# Altium schematic sheet 4G图传输原理图AD9.SchDoc
size A0; SheetNumber: 0; SheetTotal: 0
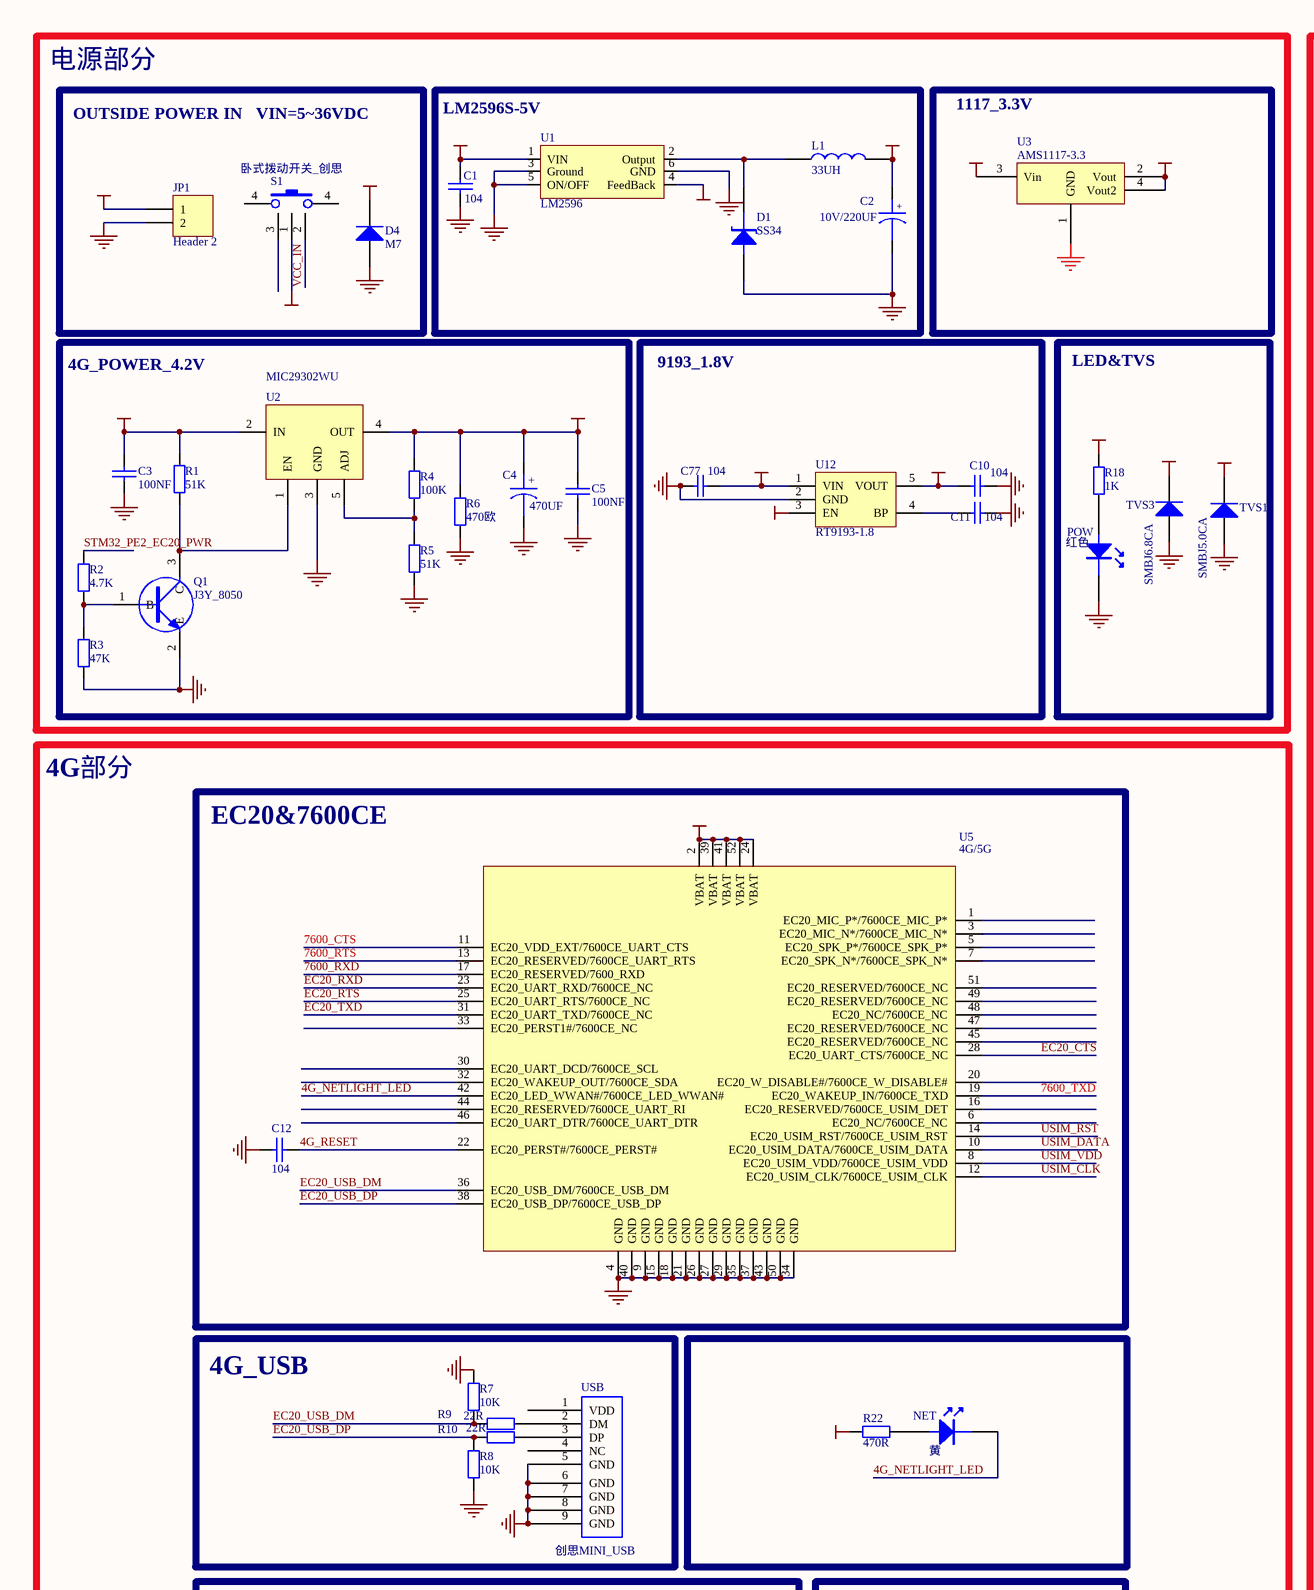
[diagram p0: 4G图传输原理图AD9.SchDoc, top left]
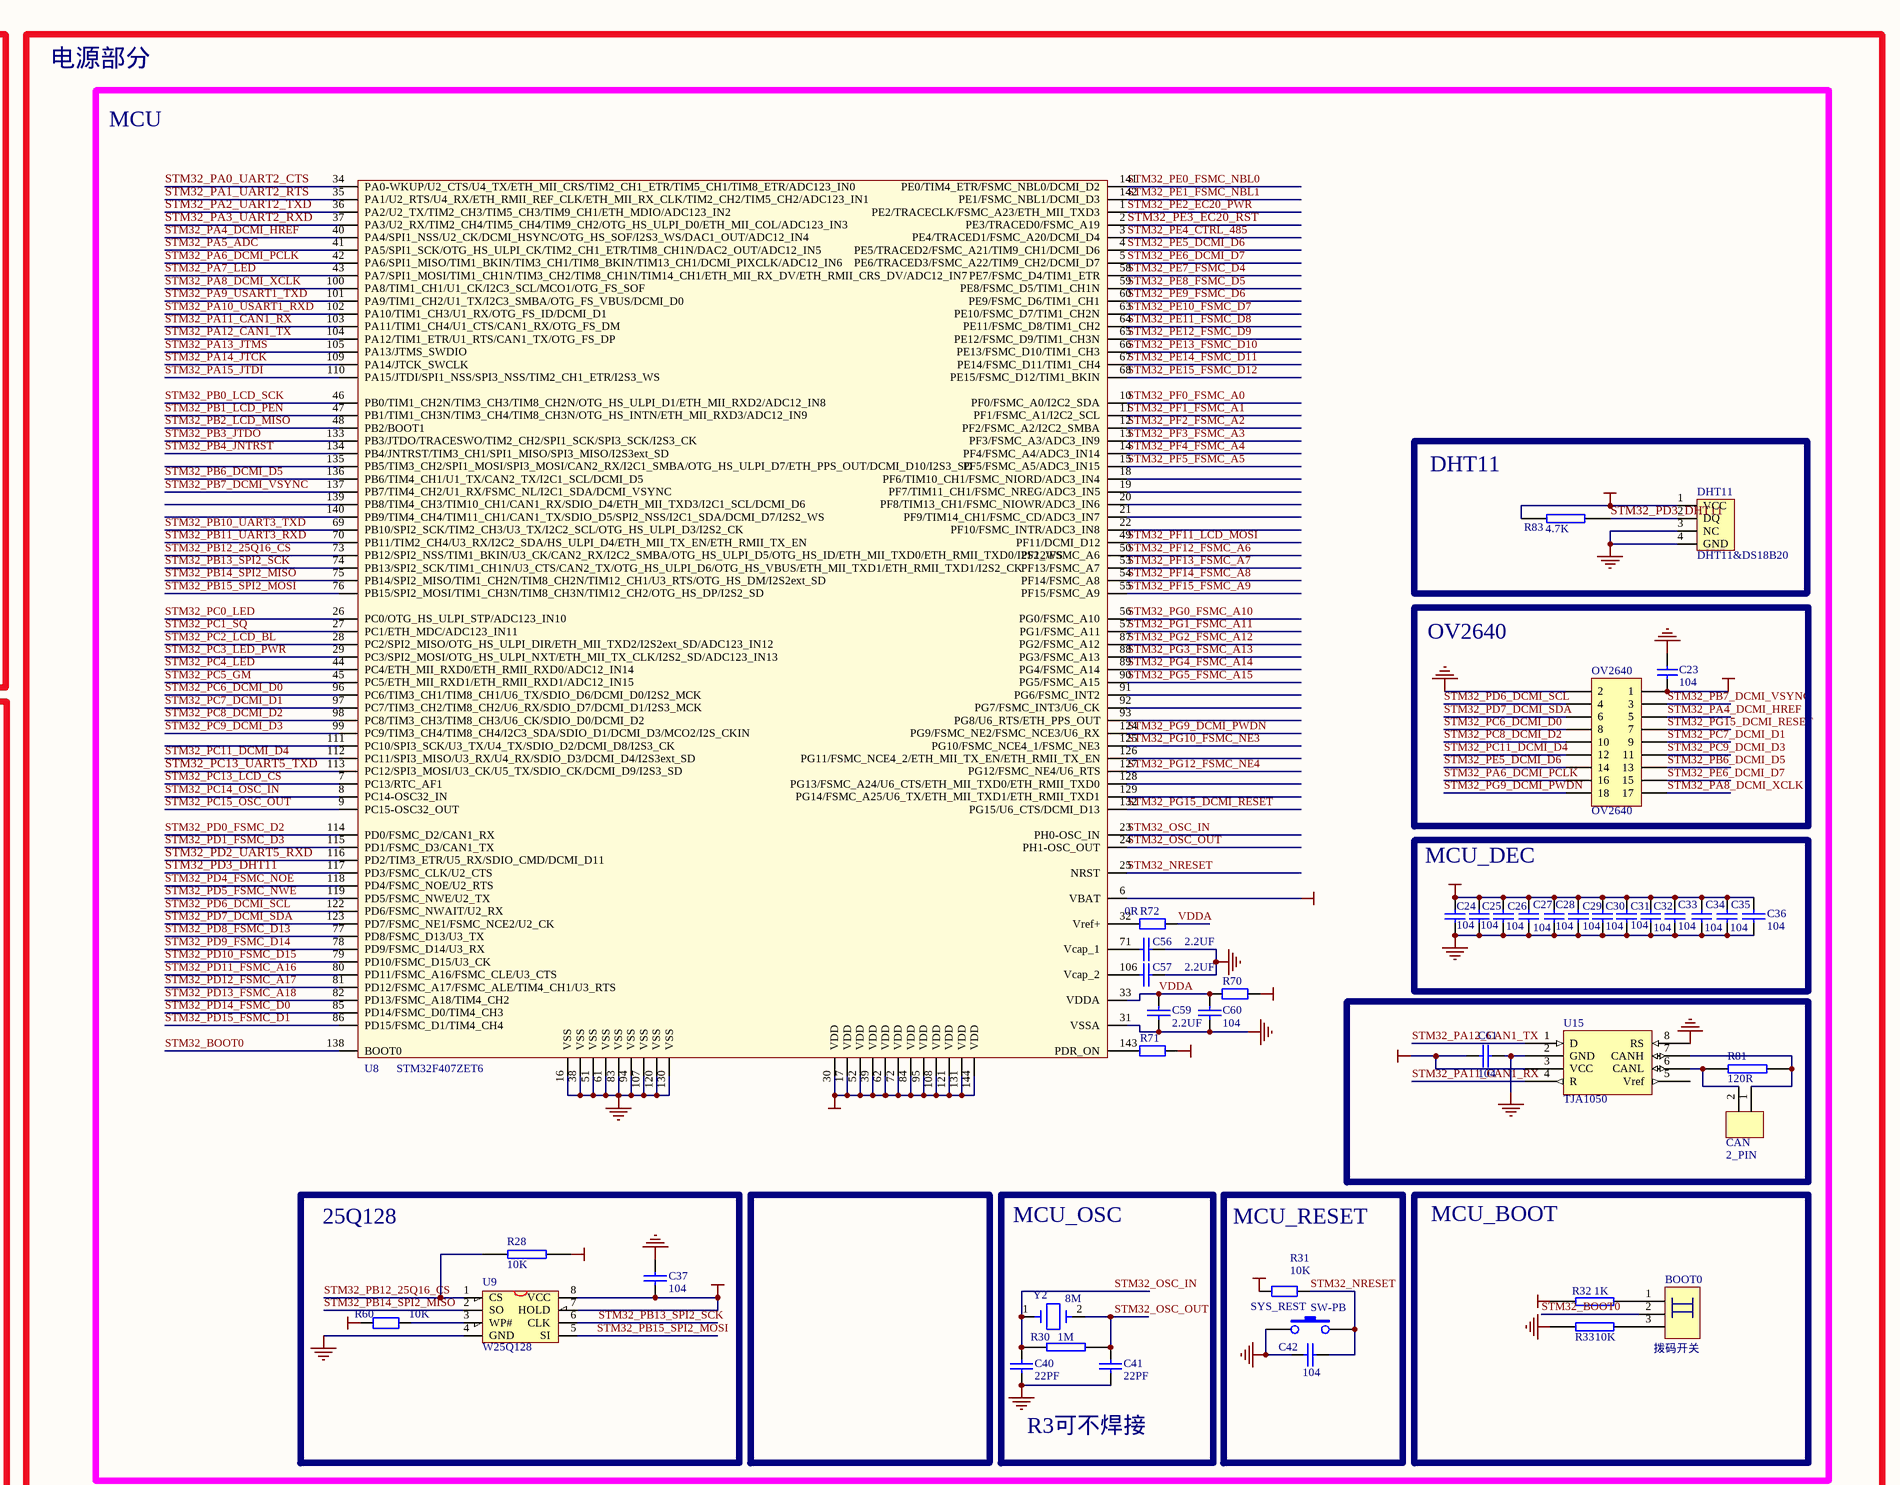
[diagram p1: 4G图传输原理图AD9.SchDoc, top right]
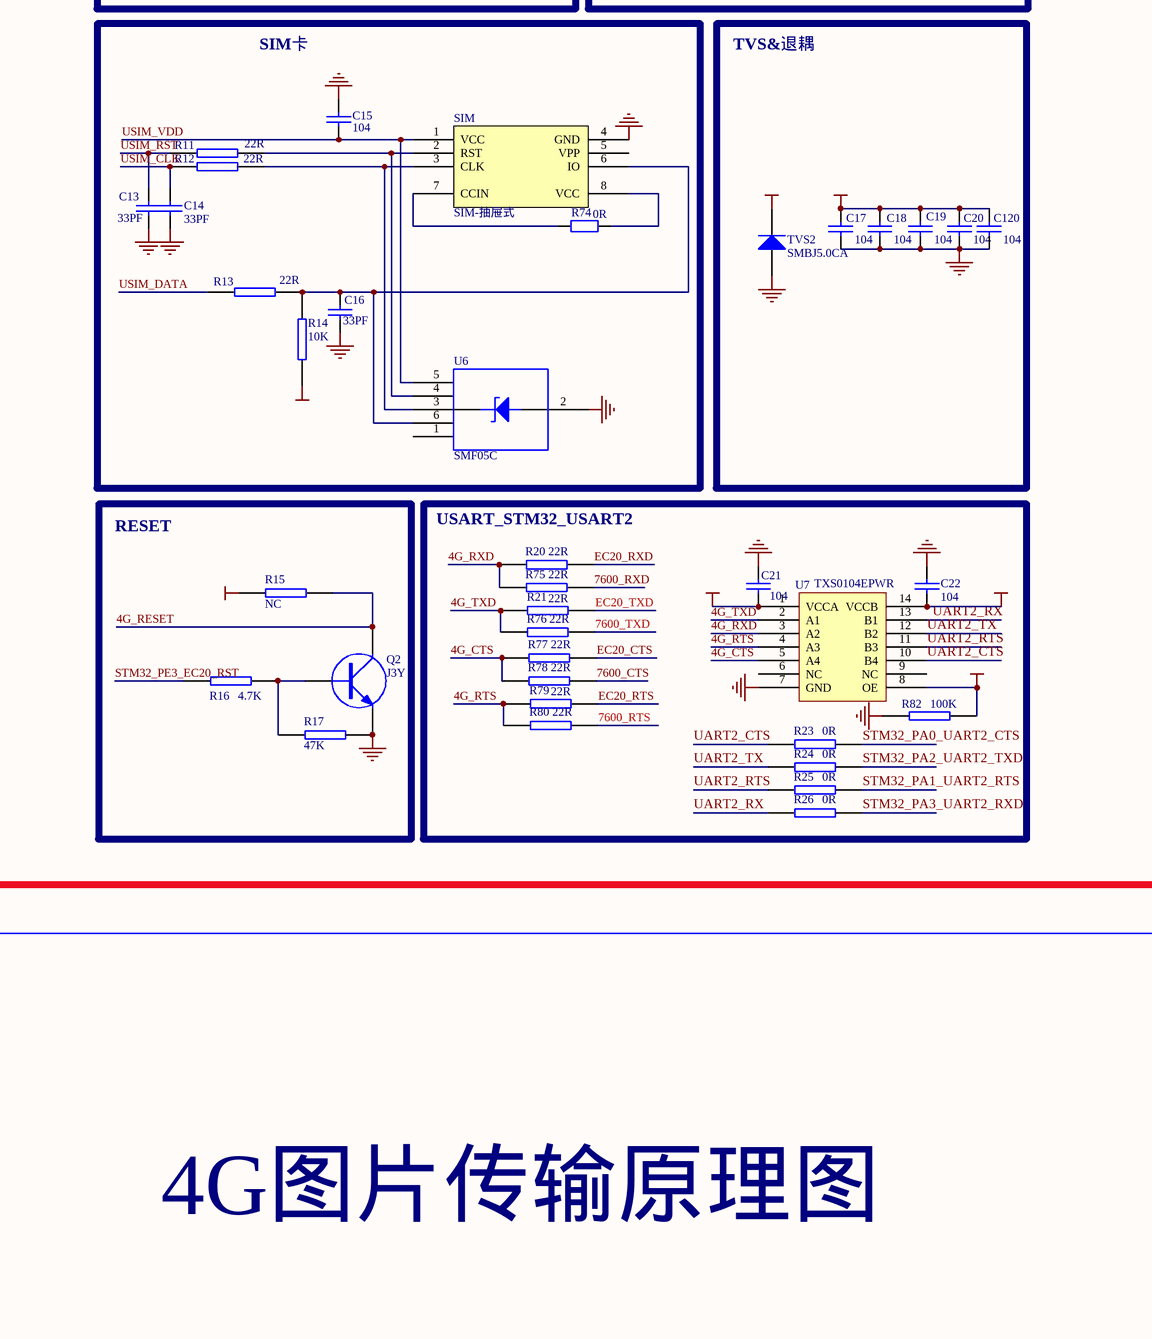
[diagram p2: 4G图传输原理图AD9.SchDoc, bottom left]
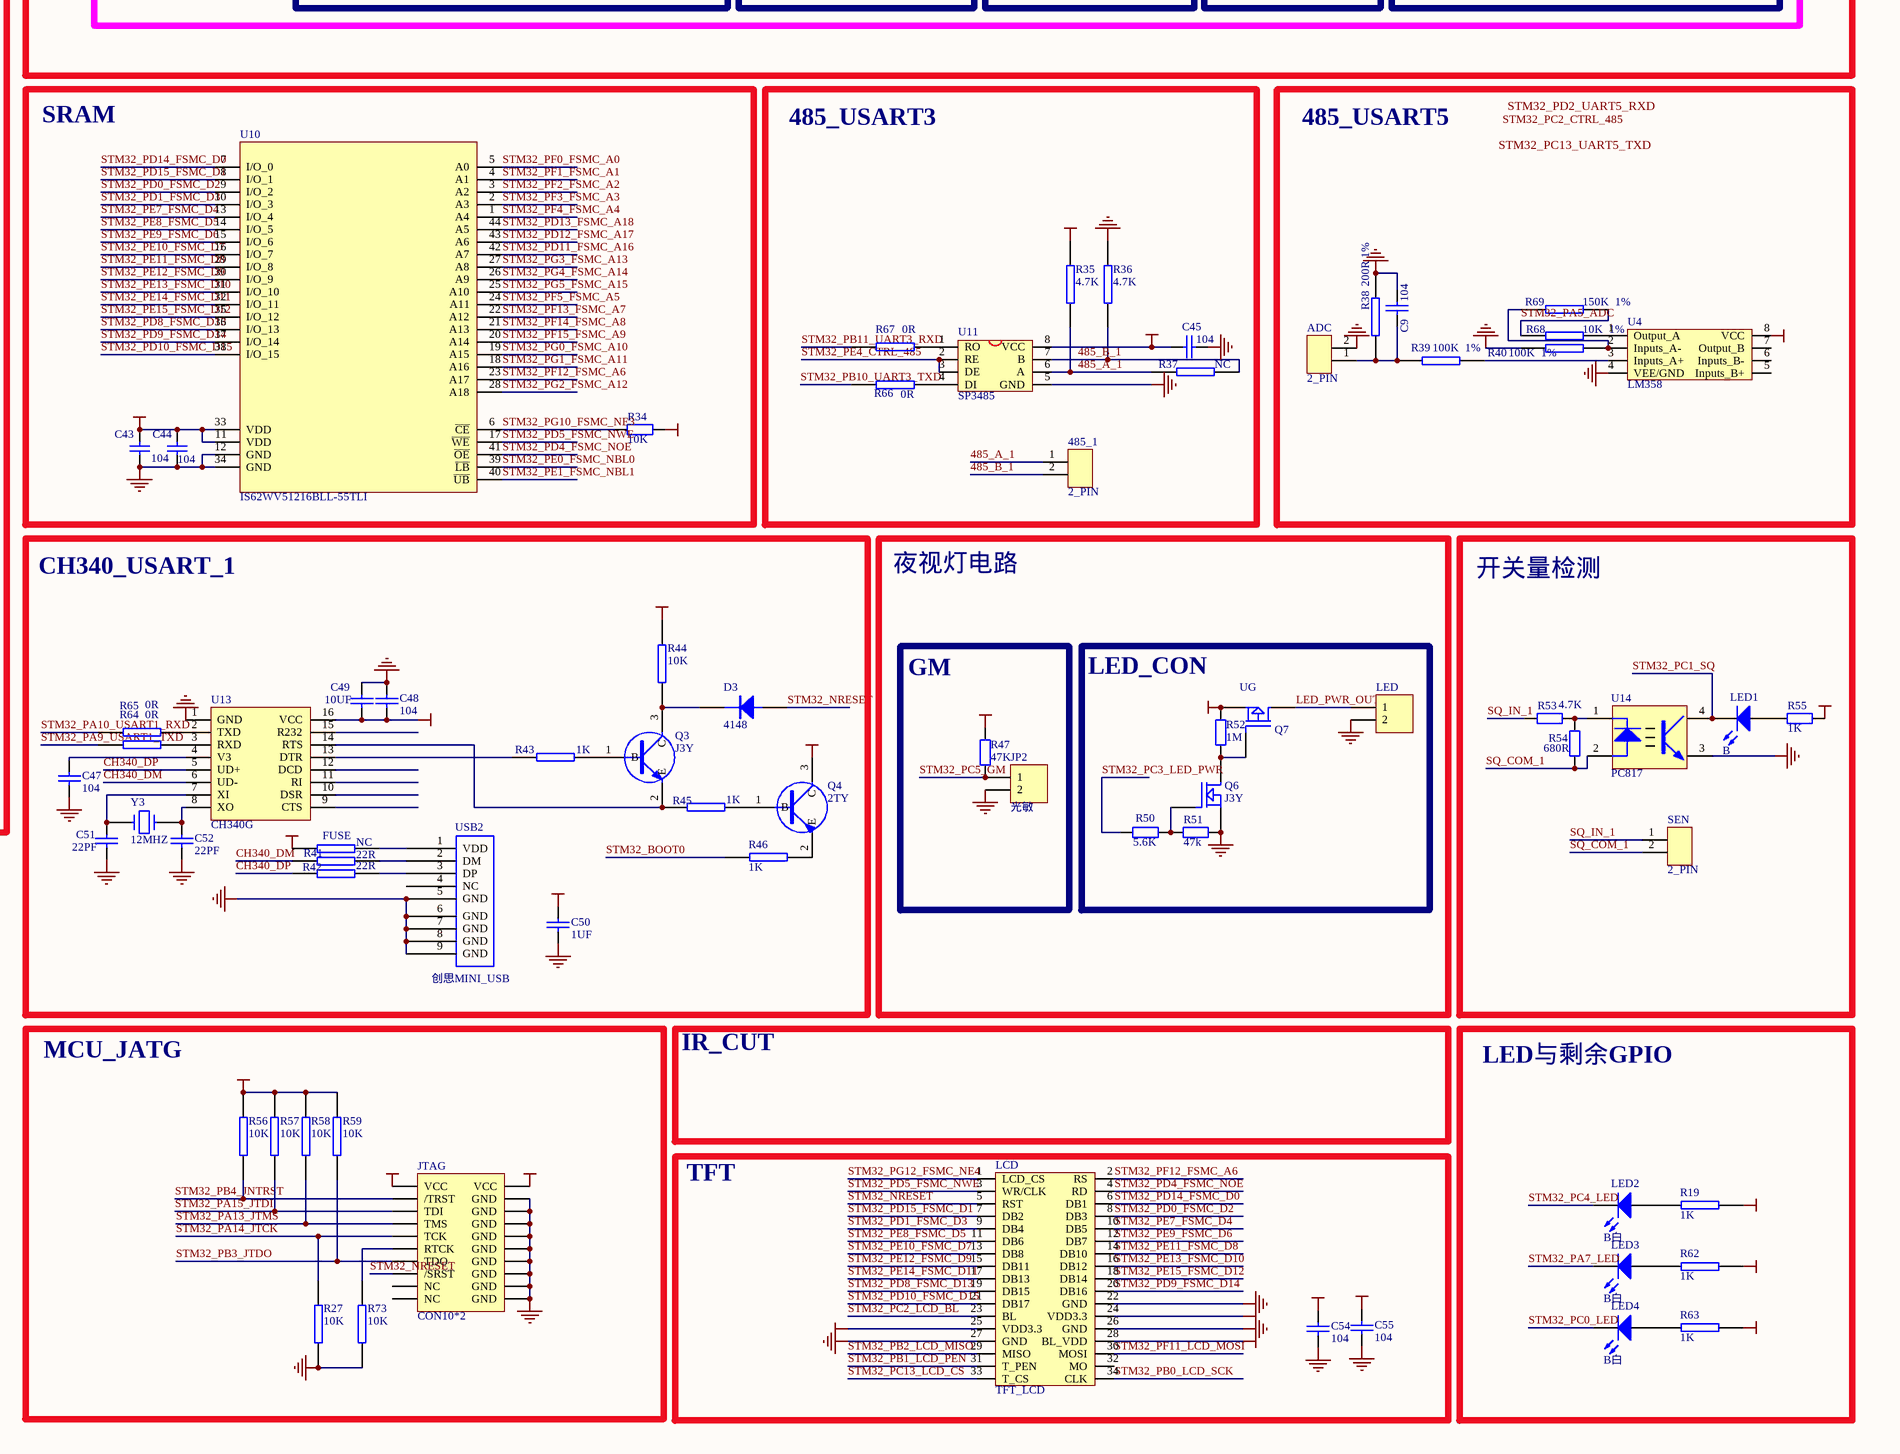
[diagram p3: 4G图传输原理图AD9.SchDoc, bottom right]

## Parts
485_1  2_PIN  [5mm间距蓝色立式端子2P]
ADC  2_PIN  [5mm间距蓝色立式端子2P]
BOOT0  拨码开关  [创思水墨屏拨码开关]
C1  104  [C_0805_创思]
C2  10V/220UF  [C_220UF/50V]
C3  100NF  [C_0805_创思]
C4  470UF  [470UF_贴片电容]
C5  100NF  [C_0805_创思]
C9  104  [C_0805_创思]
C10  value 104  [C_0805_创思]  (hidden comment: Cap)
C11  value 104  [C_0805_创思]  (hidden comment: Cap)
C12  104  [C_0805_创思]
C13  33PF  [C_0805_创思]
C14  33PF  [C_0805_创思]
C15  104  [C_0805_创思]
C16  33PF  [C_0805_创思]
C17  104  [C_0805_创思]
C18  104  [C_0805_创思]
C19  104  [C_0805_创思]
C20  104  [C_0805_创思]
C21  104  [C_0805_创思]
C22  104  [C_0805_创思]
C23  104  [C_0805_创思]
C24  104  [C_0805_创思]
C25  104  [C_0805_创思]
C26  104  [C_0805_创思]
C27  104  [C_0805_创思]
C28  104  [C_0805_创思]
C29  104  [C_0805_创思]
C30  104  [C_0805_创思]
C31  104  [C_0805_创思]
C32  104  [C_0805_创思]
C33  104  [C_0805_创思]
C34  104  [C_0805_创思]
C35  104  [C_0805_创思]
C36  104  [C_0805_创思]
C37  104  [C_0805_创思]
C40  22PF  [C_0805_创思]
C41  22PF  [C_0805_创思]
C42  104  [C_0805_创思]
C43  104  [C_0805_创思]
C44  104  [C_0805_创思]
C45  104  [C_0805_创思]
C47  104  [C_0805_创思]
C48  104  [C_0805_创思]
C49  10UF  [C_0805_创思]
C50  1UF  [C_0805_创思]
C51  22PF  [C_0805_创思]
C52  22PF  [C_0805_创思]
C54  104  [C_0805_创思]
C55  104  [C_0805_创思]
C56  2.2UF  [C_0805_创思]
C57  2.2UF  [C_0805_创思]
C59  2.2UF  [C_0805_创思]
C60  104  [C_0805_创思]
C61  104  [C_0805_创思]
C77  value 104  [C_0805_创思]  (hidden comment: Cap)
C120  104  [C_0805_创思]
CAN  2_PIN  [5mm间距蓝色立式端子2P]
D1  SS34  [5822]
D3  4148  [4148]
D4  M7  [5822]
DHT11  DHT11&DS18B20  [DHT11]
FUSE  NC  [R_0805_创思]
JP1  Header 2  [电源_卧]
JP2  光敏  [插件光敏电阻]
JTAG  CON10*2  [JTAG_创思]
L1  33UH  [100UH插件功率电感]
LCD  TFT_LCD  [TFT_LCD]
LED  + -  [HDR1X2]  (value not drawn)
LED1  B  [D_0805_创思]
LED2  B白  [D_0805_创思]
LED3  B白  [D_0805_创思]
LED4  B白  [D_0805_创思]
NET  黄  [D_0805_创思]
OV2640  OV2640  [OV2640模块_弯角]
POW  红色  [D_0805_创思]
Q1  J3Y_8050  [J3Y_8050]
Q2  J3Y  [J3Y_8050]
Q3  J3Y  [J3Y_8050]
Q4  2TY  [J3Y_8050]
Q6  J3Y  [SOT23&SOT723]
Q7  UG  [SOT-23]
R1  51K  [R_0805_创思]
R2  4.7K  [R_0805_创思]
R3  47K  [R_0805_创思]
R4  100K  [R_0805_创思]
R5  51K  [R_0805_创思]
R6  470欧  [R_0805_创思]
R7  10K  [R_0805_创思]
R8  10K  [R_0805_创思]
R9  22R  [R_0805_创思]
R10  22R  [R_0805_创思]
R11  22R  [R_0805_创思]
R12  22R  [R_0805_创思]
R13  22R  [R_0805_创思]
R14  10K  [R_0805_创思]
R15  NC  [R_0805_创思]
R16  4.7K  [R_0805_创思]
R17  47K  [R_0805_创思]
R18  1K  [R_0805_创思]
R19  1K  [R_0805_创思]
R20  22R  [R_0805_创思]
R21  22R  [R_0805_创思]
R22  470R  [R_0805_创思]
R23  0R  [R_0805_创思]
R24  0R  [R_0805_创思]
R25  0R  [R_0805_创思]
R26  0R  [R_0805_创思]
R27  10K  [R_0805_创思]
R28  10K  [R_0805_创思]
R30  1M  [R_0805_创思]
R31  10K  [R_0805_创思]
R32  1K  [R_0805_创思]
R33  10K  [R_0805_创思]
R34  10K  [R_0805_创思]
R35  4.7K  [R_0805_创思]
R36  4.7K  [R_0805_创思]
R37  NC  [R_0805_创思]
R38  200R 1%  [R_0805_创思]
R39  100K  1%  [R_0805_创思]
R40  100K  1%  [R_0805_创思]
R41  22R  [R_0805_创思]
R42  22R  [R_0805_创思]
R43  1K  [R_0805_创思]
R44  10K  [R_0805_创思]
R45  1K  [R_0805_创思]
R46  1K  [R_0805_创思]
R47  47K  [R_0805_创思]
R50  5.6K  [R_0805_创思]
R51  47k  [R_0805_创思]
R52  1M  [R_0805_创思]
R53  4.7K  [R_0805_创思]
R54  680R  [R_0805_创思]
R55  1K  [R_0805_创思]
R56  10K  [R_0805_创思]
R57  10K  [R_0805_创思]
R58  10K  [R_0805_创思]
R59  10K  [R_0805_创思]
R60  10K  [R_0805_创思]
R62  1K  [R_0805_创思]
R63  1K  [R_0805_创思]
R64  0R  [R_0805_创思]
R65  0R  [R_0805_创思]
R66  0R  [R_0805_创思]
R67  0R  [R_0805_创思]
R68  10K  1%  [R_0805_创思]
R69  150K  1%  [R_0805_创思]
R70  0R  [R_0805_创思]  (value not drawn)
R71  0R  [R_0805_创思]  (value not drawn)
R72  0R  [R_0805_创思]
R73  10K  [R_0805_创思]
R74  0R  [R_0805_创思]
R75  22R  [R_0805_创思]
R76  22R  [R_0805_创思]
R77  22R  [R_0805_创思]
R78  22R  [R_0805_创思]
R79  22R  [R_0805_创思]
R80  22R  [R_0805_创思]
R81  120R  [R_0805_创思]
R82  100K  [R_0805_创思]
R83  4.7K  [R_0805_创思]
S1  卧式拨动开关_创思  [卧式拨动开关_创思]
SEN  2_PIN  [5mm间距蓝色立式端子2P]
SIM  SIM-抽屉式  [SIMCARD8]
SYS_REST  SW-PB  [BTN]
TVS1  SMBJ5.0CA  [IN4007]
TVS2  SMBJ5.0CA  [IN4007]
TVS3  SMBJ6.8CA  [IN4007]
U1  LM2596  [LM2576]
U2  MIC29302WU  [29302]
U3  AMS1117-3.3  [SPX1117]
U4  LM358  [SOP_8_N]
U5  4G/5G  [3G/4G模块_PCI]
U6  SMF05C  [SOT-363]
U7  TXS0104EPWR  [TSSOP-14N]
U8  STM32F407ZET6  [LQFP144]
U9  W25Q128  [SOIC-8]
U10  IS62WV51216BLL-55TLI  [TSOP44]
U11  SP3485  [SOP_8_N]
U12  RT9193-1.8  [RT9193-33]
U13  CH340G  [SOP16]
U14  PC817  [PC817贴片]
U15  TJA1050  [SOP-8]
USB  创思MINI_USB  [创思MINI_USB]
USB2  创思MINI_USB  [创思MINI_USB]
Y2  8M  [晶振2 - duplicate]
Y3  12MHZ  [晶振2 - duplicate]

## Blocks framed on the sheet
电源部分: C40 C41 C56 C57 C59-C61 CAN R30 R70-R72 R81 U8 U15 Y2
OUTSIDE POWER IN   VIN=5~36VDC: D4 JP1 S1
LM2596S-5V: C1 C2 D1 L1 U1
1117_3.3V: U3
4G_POWER_4.2V: C3-C5 Q1 R1-R6 U2
9193_1.8V: C10 C11 C77 U12
LED&TVS: POW R18 TVS1 TVS3
DHT11: DHT11 R83
OV2640: C23 OV2640
4G部分: NET R22
EC20&7600CE: C12 U5
MCU_DEC: C24-C36
25Q128: C37 R28 R60 U9
MCU_RESET: C42 R31 SYS_REST
MCU_BOOT: BOOT0 R32 R33
4G_USB: R7-R10 USB
SIM卡: C13-C16 R11-R14 R74 SIM U6
TVS&退耦: C17-C20 C120 TVS2
SRAM: C43 C44 R34 U10
485_USART3: 485_1 C45 R35-R37 R66 R67 U11
485_USART5: ADC C9 R38-R40 R68 R69 U4
RESET: Q2 R15-R17
USART_STM32_USART2: C21 C22 R20 R21 R23-R26 R75-R80 R82 U7
CH340_USART_1: C47-C52 D3 FUSE Q3 Q4 R41-R46 R64 R65 U13 USB2 Y3
开关量检测: LED1 R53-R55 SEN U14
GM: JP2 R47
LED_CON: LED Q6 Q7 R50-R52
MCU_JATG: JTAG R27 R56-R59 R73
LED与剩余GPIO: LED2-LED4 R19 R62 R63
TFT: C54 C55 LCD

## Nets
GND: ADC.2 C1.2 C2.2 C3.1 C4.2 C5.1 C9.1 C10.2 C11.2 C12.2 C13.1 C14.2 C15.2 C16.1 C17.1 C18.1 C19.1 C20.1 C21.2 C22.2 C23.1 C24.1 C25.1 C26.1 C27.1 C28.1 C29.1 C30.1 C31.1 C32.1 C33.1 C34.1 C35.1 C36.2 C37.2 C40.2 C41.2 C42.2 C43.1 C44.1 C45.2 C47.2 C48.2 C49.2 C50.1 C51.1 C52.1 C54.1 C55.1 C56.2 C57.2 C59.2 C60.2 C61.1 C77.1 C120.1 D1.1 D4.1(A) DHT11.3(NC) DHT11.4(GND) JP1.2 JP2.2 JTAG.4(GND) JTAG.6(GND) JTAG.8(GND) JTAG.10(GND) JTAG.12(GND) JTAG.14(GND) JTAG.16(GND) JTAG.18(GND) JTAG.20(GND) LCD.22(GND) LCD.26(GND) LCD.27(GND) LED.2 OV2640.2 POW.2 Q1.2(E) Q2.2(E) Q6.2(S) R3.2 R5.2 R6.2 R7.2 R8.1 R17.1 R27.1 R33.1 R36.2 R38.1 R40.1 R51.2 R73.1 R82.2 SIM.4(GND) SYS_REST.1 TVS1.1(A) TVS2.1(A) TVS3.1(A) U1.3(Ground) U1.5(ON/OFF) U1.6(GND) U2.3(GND) U3.1(GND) U4.4(VEE/GND) U5.4(GND) U5.9(GND) U5.15(GND) U5.18(GND) U5.21(GND) U5.26(GND) U5.27(GND) U5.29(GND) U5.34(GND) U5.35(GND) U5.37(GND) U5.40(GND) U5.43(GND) U5.50(GND) U6.2(K) U7.7(GND) U8.16(VSS) U8.31(VSSA) U8.38(VSS) U8.51(VSS) U8.61(VSS) U8.83(VSS) U8.94(VSS) U8.107(VSS) U8.120(VSS) U8.130(VSS) U9.4(GND) U10.12(GND) U10.34(GND) U11.5(GND) U12.2(GND) U13.1(GND) U14.3 U15.2(GND) U15.8(RS) USB.5(GND) USB.6(GND) USB.7(GND) USB.8(GND) USB.9(GND) USB2.5(GND) USB2.6(GND) USB2.7(GND) USB2.8(GND) USB2.9(GND)
USIM_VDD: C15.1 R14.2 SIM.1(VCC) U5.8(EC20_USIM_VDD/7600CE_USIM_VDD) U6.5
VCC_1.8V: C10.1 C21.1 R82.1 U7.1(VCCA) U7.8(OE) U12.5(VOUT)
VCC_3.3V: C22.1 C23.2 C24.2 C25.2 C26.2 C27.2 C28.2 C29.2 C30.2 C31.2 C32.2 C33.2 C34.2 C35.2 C36.1 C37.1 C43.2 C44.2 C45.1 C55.2 C77.2 DHT11.1(VCC) JTAG.1(VCC) JTAG.2(VCC) LCD.24(VDD3.3) LCD.25(VDD3.3) OV2640.1 Q4.3(C) R18.2 R19.1 R28.1 R31.1 R32.2 R34.2 R35.2 R44.1 R47.1 R55.2 R56.2 R57.2 R58.2 R59.2 R60.1 R62.1 R63.1 R70.1 R71.1 R83.1 TVS1.2(K) U3.2(Vout) U3.4(Vout2) U4.8(VCC) U7.14(VCCB) U8.6(VBAT) U8.17(VDD) U8.30(VDD) U8.39(VDD) U8.52(VDD) U8.62(VDD) U8.72(VDD) U8.84(VDD) U8.95(VDD) U8.108(VDD) U8.121(VDD) U8.131(VDD) U8.144(VDD) U9.7(HOLD) U9.8(VCC) U10.11(VDD) U10.33(VDD) U11.8(VCC) U12.1(VIN) U12.3(EN)
VCC_3.8V: C4.1 C5.2 C17.2 C18.2 C19.2 C20.2 C120.2 R4.1 R6.1 R15.2 R22.2 TVS2.2(K) U2.4(OUT) U5.2(VBAT) U5.24(VBAT) U5.39(VBAT) U5.41(VBAT) U5.52(VBAT)
VCC_5V: C2.1 C3.2 C48.1 C49.1 C50.2 C54.2 C61.2 FUSE.2 L1.2 LCD.28(BL_VDD) R1.1 TVS3.2(K) U1.4(FeedBack) U2.2(IN) U3.3(Vin) U13.16(VCC) U15.3(VCC)
VCC_12V: C1.1 Q7.2(S) R52.2 S1.1 U1.1(VIN)
VCC_IN: D4.2(K) JP1.1 S1.2
4G_CTS: R77.2 R78.2 U7.5(A4)
4G_NETLIGHT_LED: NET.2 U5.42(EC20_LED_WWAN#/7600CE_LED_WWAN#)
4G_RESET: C12.1 Q2.3(C) R15.1 U5.22(EC20_PERST#/7600CE_PERST#)
4G_RTS: R79.2 R80.2 U7.4(A3)
4G_RXD: R20.2 R75.2 U7.3(A2)
4G_TXD: R21.2 R76.2 U7.2(A1)
485_A_1: 485_1.1 R35.1 R37.1 U11.6(A)
485_B_1: 485_1.2 R36.1 R37.2 U11.7(B)
7600_CTS: R78.1 U5.11(EC20_VDD_EXT/7600CE_UART_CTS)
7600_RTS: R80.1 U5.13(EC20_RESERVED/7600CE_UART_RTS)
7600_RXD: R75.1 U5.17(EC20_RESERVED/7600_RXD)
7600_TXD: R76.1 U5.19(EC20_WAKEUP_IN/7600CE_TXD)
CH340_DM: R41.2 U13.6(UD-)
CH340_DP: R42.2 U13.5(UD+)
EC20_CTS: R77.1 U5.28(EC20_UART_CTS/7600CE_NC)
EC20_RTS: R79.1 U5.25(EC20_UART_RTS/7600CE_NC)
EC20_RXD: R20.1 U5.23(EC20_UART_RXD/7600CE_NC)
EC20_TXD: R21.1 U5.31(EC20_UART_TXD/7600CE_NC)
EC20_USB_DM: R7.1 R9.2 U5.36(EC20_USB_DM/7600CE_USB_DM)
EC20_USB_DP: R8.2 R10.2 U5.38(EC20_USB_DP/7600CE_USB_DP)
LED_PWR_OUT: LED.1 Q7.3(D)
SQ_COM_1: R54.2 SEN.2 U14.2
SQ_IN_1: R53.2 SEN.1
STM32_BOOT0: BOOT0.2 R46.1 U8.138(BOOT0)
STM32_NRESET: C42.1 D3.1 JTAG.15(/SRST) LCD.5(RST) R31.2 SYS_REST.2 U8.25(NRST)
STM32_OSC_IN: C40.1 R30.1 U8.23(PH0-OSC_IN) Y2.1
STM32_OSC_OUT: C41.1 R30.2 U8.24(PH1-OSC_OUT) Y2.2
STM32_PA0_UART2_CTS: R23.1 U8.34(PA0-WKUP/U2_CTS/U4_TX/ETH_MII_CRS/TIM2_CH1_ETR/TIM5_CH1/TIM8_ETR/ADC123_IN0)
STM32_PA1_UART2_RTS: R25.1 U8.35(PA1/U2_RTS/U4_RX/ETH_RMII_REF_CLK/ETH_MII_RX_CLK/TIM2_CH2/TIM5_CH2/ADC123_IN1)
STM32_PA2_UART2_TXD: R24.1 U8.36(PA2/U2_TX/TIM2_CH3/TIM5_CH3/TIM9_CH1/ETH_MDIO/ADC123_IN2)
STM32_PA3_UART2_RXD: R26.1 U8.37(PA3/U2_RX/TIM2_CH4/TIM5_CH4/TIM9_CH2/OTG_HS_ULPI_D0/ETH_MII_COL/ADC123_IN3)
STM32_PA4_DCMI_HREF: OV2640.5 U8.40(PA4/SPI1_NSS/U2_CK/DCMI_HSYNC/OTG_HS_SOF/I2S3_WS/DAC1_OUT/ADC12_IN4)
STM32_PA5_ADC: R68.1 R69.1 U8.41(PA5/SPI1_SCK/OTG_HS_ULPI_CK/TIM2_CH1_ETR/TIM8_CH1N/DAC2_OUT/ADC12_IN5)
STM32_PA6_DCMI_PCLK: OV2640.16 U8.42(PA6/SPI1_MISO/TIM1_BKIN/TIM3_CH1/TIM8_BKIN/TIM13_CH1/DCMI_PIXCLK/ADC12_IN6)
STM32_PA7_LED: LED3.2(K) U8.43(PA7/SPI1_MOSI/TIM1_CH1N/TIM3_CH2/TIM8_CH1N/TIM14_CH1/ETH_MII_RX_DV/ETH_RMII_CRS_DV/ADC12_IN7)
STM32_PA8_DCMI_XCLK: OV2640.17 U8.100(PA8/TIM1_CH1/U1_CK/I2C3_SCL/MCO1/OTG_FS_SOF)
STM32_PA9_USART1_TXD: R64.2 U8.101(PA9/TIM1_CH2/U1_TX/I2C3_SMBA/OTG_FS_VBUS/DCMI_D0)
STM32_PA10_USART1_RXD: R65.2 U8.102(PA10/TIM1_CH3/U1_RX/OTG_FS_ID/DCMI_D1)
STM32_PA11_CAN1_RX: U8.103(PA11/TIM1_CH4/U1_CTS/CAN1_RX/OTG_FS_DM) U15.4(R)
STM32_PA12_CAN1_TX: U8.104(PA12/TIM1_ETR/U1_RTS/CAN1_TX/OTG_FS_DP) U15.1(D)
STM32_PA13_JTMS: JTAG.7(TMS) R58.1 U8.105(PA13/JTMS_SWDIO)
STM32_PA14_JTCK: JTAG.9(TCK) R27.2 U8.109(PA14/JTCK_SWCLK)
STM32_PA15_JTDI: JTAG.5(TDI) R57.1 U8.110(PA15/JTDI/SPI1_NSS/SPI3_NSS/TIM2_CH1_ETR/I2S3_WS)
STM32_PB0_LCD_SCK: LCD.34(CLK) U8.46(PB0/TIM1_CH2N/TIM3_CH3/TIM8_CH2N/OTG_HS_ULPI_D1/ETH_MII_RXD2/ADC12_IN8)
STM32_PB1_LCD_PEN: LCD.31(T_PEN) U8.47(PB1/TIM1_CH3N/TIM3_CH4/TIM8_CH3N/OTG_HS_INTN/ETH_MII_RXD3/ADC12_IN9)
STM32_PB2_LCD_MISO: LCD.29(MISO) U8.48(PB2/BOOT1)
STM32_PB3_JTDO: JTAG.13(TDO) R59.1 U8.133(PB3/JTDO/TRACESWO/TIM2_CH2/SPI1_SCK/SPI3_SCK/I2S3_CK)
STM32_PB4_JNTRST: JTAG.3(/TRST) R56.1 U8.134(PB4/JNTRST/TIM3_CH1/SPI1_MISO/SPI3_MISO/I2S3ext_SD)
STM32_PB6_DCMI_D5: OV2640.13 U8.136(PB6/TIM4_CH1/U1_TX/CAN2_TX/I2C1_SCL/DCMI_D5)
STM32_PB7_DCMI_VSYNC: OV2640.3 U8.137(PB7/TIM4_CH2/U1_RX/FSMC_NL/I2C1_SDA/DCMI_VSYNC)
STM32_PB10_UART3_TXD: R66.2 U8.69(PB10/SPI2_SCK/TIM2_CH3/U3_TX/I2C2_SCL/OTG_HS_ULPI_D3/I2S2_CK)
STM32_PB11_UART3_RXD: R67.2 U8.70(PB11/TIM2_CH4/U3_RX/I2C2_SDA/HS_ULPI_D4/ETH_MII_TX_EN/ETH_RMII_TX_EN)
STM32_PB12_25Q16_CS: R28.2 U8.73(PB12/SPI2_NSS/TIM1_BKIN/U3_CK/CAN2_RX/I2C2_SMBA/OTG_HS_ULPI_D5/OTG_HS_ID/ETH_MII_TXD0/ETH_RMII_TXD0/I2S2_WS) U9.1(CS)
STM32_PB13_SPI2_SCK: U8.74(PB13/SPI2_SCK/TIM1_CH1N/U3_CTS/CAN2_TX/OTG_HS_ULPI_D6/OTG_HS_VBUS/ETH_MII_TXD1/ETH_RMII_TXD1/I2S2_CK) U9.6(CLK)
STM32_PB14_SPI2_MISO: U8.75(PB14/SPI2_MISO/TIM1_CH2N/TIM8_CH2N/TIM12_CH1/U3_RTS/OTG_HS_DM/I2S2ext_SD) U9.2(SO)
STM32_PB15_SPI2_MOSI: U8.76(PB15/SPI2_MOSI/TIM1_CH3N/TIM8_CH3N/TIM12_CH2/OTG_HS_DP/I2S2_SD) U9.5(SI)
STM32_PC0_LED: LED4.2(K) U8.26(PC0/OTG_HS_ULPI_STP/ADC123_IN10)
STM32_PC1_SQ: LED1.2(K) U8.27(PC1/ETH_MDC/ADC123_IN11) U14.4
STM32_PC2_LCD_BL: LCD.23(BL) U8.28(PC2/SPI2_MISO/OTG_HS_ULPI_DIR/ETH_MII_TXD2/I2S2ext_SD/ADC123_IN12)
STM32_PC3_LED_PWR: R50.1 U8.29(PC3/SPI2_MOSI/OTG_HS_ULPI_NXT/ETH_MII_TX_CLK/I2S2_SD/ADC123_IN13)
STM32_PC4_LED: LED2.2(K) U8.44(PC4/ETH_MII_RXD0/ETH_RMII_RXD0/ADC12_IN14)
STM32_PC5_GM: JP2.1 R47.2 U8.45(PC5/ETH_MII_RXD1/ETH_RMII_RXD1/ADC12_IN15)
STM32_PC6_DCMI_D0: OV2640.8 U8.96(PC6/TIM3_CH1/TIM8_CH1/U6_TX/SDIO_D6/DCMI_D0/I2S2_MCK)
STM32_PC7_DCMI_D1: OV2640.9 U8.97(PC7/TIM3_CH2/TIM8_CH2/U6_RX/SDIO_D7/DCMI_D1/I2S3_MCK)
STM32_PC8_DCMI_D2: OV2640.10 U8.98(PC8/TIM3_CH3/TIM8_CH3/U6_CK/SDIO_D0/DCMI_D2)
STM32_PC9_DCMI_D3: OV2640.11 U8.99(PC9/TIM3_CH4/TIM8_CH4/I2C3_SDA/SDIO_D1/DCMI_D3/MCO2/I2S_CKIN)
STM32_PC11_DCMI_D4: OV2640.12 U8.112(PC11/SPI3_MISO/U3_RX/U4_RX/SDIO_D3/DCMI_D4/I2S3ext_SD)
STM32_PC13_LCD_CS: LCD.33(T_CS) U8.7(PC13/RTC_AF1)
STM32_PC13_UART5_TXD: U8.113(PC12/SPI3_MOSI/U3_CK/U5_TX/SDIO_CK/DCMI_D9/I2S3_SD)
STM32_PC14_OSC_IN: U8.8(PC14-OSC32_IN)
STM32_PC15_OSC_OUT: U8.9(PC15-OSC32_OUT)
STM32_PD0_FSMC_D2: LCD.8(DB3) U8.114(PD0/FSMC_D2/CAN1_RX) U10.9(I/O_2)
STM32_PD1_FSMC_D3: LCD.9(DB4) U8.115(PD1/FSMC_D3/CAN1_TX) U10.10(I/O_3)
STM32_PD2_UART5_RXD: U8.116(PD2/TIM3_ETR/U5_RX/SDIO_CMD/DCMI_D11)
STM32_PD3_DHT11: DHT11.2(DQ) R83.2 U8.117(PD3/FSMC_CLK/U2_CTS)
STM32_PD4_FSMC_NOE: LCD.4(RD) U8.118(PD4/FSMC_NOE/U2_RTS) U10.41(~{OE})
STM32_PD5_FSMC_NWE: LCD.3(WR/CLK) U8.119(PD5/FSMC_NWE/U2_TX) U10.17(~{WE})
STM32_PD6_DCMI_SCL: OV2640.4 U8.122(PD6/FSMC_NWAIT/U2_RX)
STM32_PD7_DCMI_SDA: OV2640.6 U8.123(PD7/FSMC_NE1/FSMC_NCE2/U2_CK)
STM32_PD8_FSMC_D13: LCD.19(DB15) U8.77(PD8/FSMC_D13/U3_TX) U10.36(I/O_13)
STM32_PD9_FSMC_D14: LCD.20(DB16) U8.78(PD9/FSMC_D14/U3_RX) U10.37(I/O_14)
STM32_PD10_FSMC_D15: LCD.21(DB17) U8.79(PD10/FSMC_D15/U3_CK) U10.38(I/O_15)
STM32_PD11_FSMC_A16: U8.80(PD11/FSMC_A16/FSMC_CLE/U3_CTS) U10.42(A7)
STM32_PD12_FSMC_A17: U8.81(PD12/FSMC_A17/FSMC_ALE/TIM4_CH1/U3_RTS) U10.43(A6)
STM32_PD13_FSMC_A18: U8.82(PD13/FSMC_A18/TIM4_CH2) U10.44(A5)
STM32_PD14_FSMC_D0: LCD.6(DB1) U8.85(PD14/FSMC_D0/TIM4_CH3) U10.7(I/O_0)
STM32_PD15_FSMC_D1: LCD.7(DB2) U8.86(PD15/FSMC_D1/TIM4_CH4) U10.8(I/O_1)
STM32_PE0_FSMC_NBL0: U8.141(PE0/TIM4_ETR/FSMC_NBL0/DCMI_D2) U10.39(~{LB})
STM32_PE1_FSMC_NBL1: U8.142(PE1/FSMC_NBL1/DCMI_D3) U10.40(~{UB})
STM32_PE2_EC20_PWR: R2.2 U8.1(PE2/TRACECLK/FSMC_A23/ETH_MII_TXD3)
STM32_PE3_EC20_RST: R16.2 U8.2(PE3/TRACED0/FSMC_A19)
STM32_PE4_CTRL_485: U8.3(PE4/TRACED1/FSMC_A20/DCMI_D4) U11.2(RE) U11.3(DE)
STM32_PE5_DCMI_D6: OV2640.14 U8.4(PE5/TRACED2/FSMC_A21/TIM9_CH1/DCMI_D6)
STM32_PE6_DCMI_D7: OV2640.15 U8.5(PE6/TRACED3/FSMC_A22/TIM9_CH2/DCMI_D7)
STM32_PE7_FSMC_D4: LCD.10(DB5) U8.58(PE7/FSMC_D4/TIM1_ETR) U10.13(I/O_4)
STM32_PE8_FSMC_D5: LCD.11(DB6) U8.59(PE8/FSMC_D5/TIM1_CH1N) U10.14(I/O_5)
STM32_PE9_FSMC_D6: LCD.12(DB7) U8.60(PE9/FSMC_D6/TIM1_CH1) U10.15(I/O_6)
STM32_PE10_FSMC_D7: LCD.13(DB8) U8.63(PE10/FSMC_D7/TIM1_CH2N) U10.16(I/O_7)
STM32_PE11_FSMC_D8: LCD.14(DB10) U8.64(PE11/FSMC_D8/TIM1_CH2) U10.29(I/O_8)
STM32_PE12_FSMC_D9: LCD.15(DB11) U8.65(PE12/FSMC_D9/TIM1_CH3N) U10.30(I/O_9)
STM32_PE13_FSMC_D10: LCD.16(DB12) U8.66(PE13/FSMC_D10/TIM1_CH3) U10.31(I/O_10)
STM32_PE14_FSMC_D11: LCD.17(DB13) U8.67(PE14/FSMC_D11/TIM1_CH4) U10.32(I/O_11)
STM32_PE15_FSMC_D12: LCD.18(DB14) U8.68(PE15/FSMC_D12/TIM1_BKIN) U10.35(I/O_12)
STM32_PF0_FSMC_A0: U8.10(PF0/FSMC_A0/I2C2_SDA) U10.5(A0)
STM32_PF1_FSMC_A1: U8.11(PF1/FSMC_A1/I2C2_SCL) U10.4(A1)
STM32_PF2_FSMC_A2: U8.12(PF2/FSMC_A2/I2C2_SMBA) U10.3(A2)
STM32_PF3_FSMC_A3: U8.13(PF3/FSMC_A3/ADC3_IN9) U10.2(A3)
STM32_PF4_FSMC_A4: U8.14(PF4/FSMC_A4/ADC3_IN14) U10.1(A4)
STM32_PF5_FSMC_A5: U8.15(PF5/FSMC_A5/ADC3_IN15) U10.24(A11)
STM32_PF11_LCD_MOSI: LCD.30(MOSI) U8.49(PF11/DCMI_D12)
STM32_PF12_FSMC_A6: LCD.2(RS) U8.50(PF12/FSMC_A6) U10.23(A17)
STM32_PF13_FSMC_A7: U8.53(PF13/FSMC_A7) U10.22(A12)
STM32_PF14_FSMC_A8: U8.54(PF14/FSMC_A8) U10.21(A13)
STM32_PF15_FSMC_A9: U8.55(PF15/FSMC_A9) U10.20(A14)
STM32_PG0_FSMC_A10: U8.56(PG0/FSMC_A10) U10.19(A15)
STM32_PG1_FSMC_A11: U8.57(PG1/FSMC_A11) U10.18(A16)
STM32_PG2_FSMC_A12: U8.87(PG2/FSMC_A12) U10.28(A18)
STM32_PG3_FSMC_A13: U8.88(PG3/FSMC_A13) U10.27(A8)
STM32_PG4_FSMC_A14: U8.89(PG4/FSMC_A14) U10.26(A9)
STM32_PG5_FSMC_A15: U8.90(PG5/FSMC_A15) U10.25(A10)
STM32_PG9_DCMI_PWDN: OV2640.18 U8.124(PG9/FSMC_NE2/FSMC_NCE3/U6_RX)
STM32_PG10_FSMC_NE3: R34.1 U8.125(PG10/FSMC_NCE4_1/FSMC_NE3) U10.6(~{CE})
STM32_PG12_FSMC_NE4: LCD.1(LCD_CS) U8.127(PG12/FSMC_NE4/U6_RTS)
STM32_PG15_DCMI_RESET: OV2640.7 U8.132(PG15/U6_CTS/DCMI_D13)
UART2_CTS: R23.2 U7.10(B4)
UART2_RTS: R25.2 U7.11(B3)
UART2_RX: R26.2 U7.13(B1)
UART2_TX: R24.2 U7.12(B2)
USIM_CLK: C14.1 R12.2 U5.12(EC20_USIM_CLK/7600CE_USIM_CLK)
USIM_DATA: R13.1 U5.10(EC20_USIM_DATA/7600CE_USIM_DATA)
USIM_RST: C13.2 R11.2 U5.14(EC20_USIM_RST/7600CE_USIM_RST)
VDDA: C59.1 C60.1 R70.2 R72.1 U8.33(VDDA)
NetADC_1: ADC.1 C9.2 R38.2 R39.1
NetBOOT0_1: BOOT0.1 R32.1
NetBOOT0_3: BOOT0.3 R33.2
NetC11_1: C11.1 U12.4(BP)
NetC16_2: C16.2 R13.2 R14.1 SIM.6(IO) U6.6
NetC47_1: C47.1 U13.4(V3)
NetC51_2: C51.2 U13.7(XI) Y3.1
NetC52_2: C52.2 U13.8(XO) Y3.2
NetC56_1: C56.1 U8.71(Vcap_1)
NetC57_1: C57.1 U8.106(Vcap_2)
NetCAN_1: CAN.1 R81.1 U15.7(CANH)
NetCAN_2: CAN.2 R81.2 U15.6(CANL)
NetD1_2: D1.2 L1.1 U1.2(Output)
NetD3_2: D3.2 Q3.3(C) R44.2
NetFUSE_1: FUSE.1 USB2.1(VDD)
NetJTAG_11: JTAG.11(RTCK) R73.2
NetLED1_1: LED1.1(A) R55.1
NetLED2_1: LED2.1(A) R19.2
NetLED3_1: LED3.1(A) R62.2
NetLED4_1: LED4.1(A) R63.2
NetNET_1: NET.1 R22.1
NetPOW_1: POW.1 R18.1
NetQ1_1: Q1.1(B) R2.1 R3.1
NetQ1_3: Q1.3(C) R1.2 U2.1(EN)
NetQ2_1: Q2.1(B) R16.1 R17.2
NetQ3_1: Q3.1(B) R43.1
NetQ3_2: Q3.2(E) R45.2 U13.14(RTS)
NetQ4_1: Q4.1(B) R45.1
NetQ4_2: Q4.2(E) R46.2
NetQ6_1: Q6.1(G) R50.2 R51.1
NetQ6_3: Q6.3(D) Q7.1(G) R52.1
NetR4_2: R4.2 R5.1 U2.5(ADJ)
NetR9_1: R9.1 USB.2(DM)
NetR10_1: R10.1 USB.3(DP)
NetR11_1: R11.1 SIM.2(RST) U6.4
NetR12_1: R12.1 SIM.3(CLK) U6.3
NetR39_2: R39.2 U4.3(Inputs_A+)
NetR40_2: R40.2 R69.2 U4.2(Inputs_A-)
NetR41_1: R41.1 USB2.2(DM)
NetR42_1: R42.1 USB2.3(DP)
NetR43_2: R43.2 U13.13(DTR)
NetR53_1: R53.1 R54.1 U14.1
NetR60_2: R60.2 U9.3(WP#)
NetR64_1: R64.1 U13.3(RXD)
NetR65_1: R65.1 U13.2(TXD)
NetR66_1: R66.1 U11.4(DI)
NetR67_1: R67.1 U11.1(RO)
NetR68_2: R68.2 U4.1(Output_A)
NetR71_2: R71.2 U8.143(PDR_ON)
NetR72_2: R72.2 U8.32(Vref+)
NetR74_1: R74.1 SIM.8(VCC)
NetR74_2: R74.2 SIM.7(CCIN)

Not connected (* = marked no-connect by the designer): JTAG 17(NC) 19(NC); LCD 32(MO); S1 3 4; SIM 5(VPP); U4 5(Inputs_B+) 6(Inputs_B-) 7(Output_B); U5 1(EC20_MIC_P*/7600CE_MIC_P*) 3(EC20_MIC_N*/7600CE_MIC_N*) 5(EC20_SPK_P*/7600CE_SPK_P*) 6(EC20_NC/7600CE_NC) 7(EC20_SPK_N*/7600CE_SPK_N*) 16(EC20_RESERVED/7600CE_USIM_DET) 20(EC20_W_DISABLE#/7600CE_W_DISABLE#) 30(EC20_UART_DCD/7600CE_SCL) 32(EC20_WAKEUP_OUT/7600CE_SDA) 33(EC20_PERST1#/7600CE_NC) 44(EC20_RESERVED/7600CE_UART_RI) 45(EC20_RESERVED/7600CE_NC) 46(EC20_UART_DTR/7600CE_UART_DTR) 47(EC20_RESERVED/7600CE_NC) 48(EC20_NC/7600CE_NC) 49(EC20_RESERVED/7600CE_NC) 51(EC20_RESERVED/7600CE_NC); U6 1(A); U7 6(NC) 9(NC); U8 18(PF6/TIM10_CH1/FSMC_NIORD/ADC3_IN4) 19(PF7/TIM11_CH1/FSMC_NREG/ADC3_IN5) 20(PF8/TIM13_CH1/FSMC_NIOWR/ADC3_IN6) 21(PF9/TIM14_CH1/FSMC_CD/ADC3_IN7) 22(PF10/FSMC_INTR/ADC3_IN8) 91(PG6/FSMC_INT2) 92(PG7/FSMC_INT3/U6_CK) 93(PG8/U6_RTS/ETH_PPS_OUT) 111(PC10/SPI3_SCK/U3_TX/U4_TX/SDIO_D2/DCMI_D8/I2S3_CK) 126(PG11/FSMC_NCE4_2/ETH_MII_TX_EN/ETH_RMII_TX_EN) 128(PG13/FSMC_A24/U6_CTS/ETH_MII_TXD0/ETH_RMII_TXD0) 129(PG14/FSMC_A25/U6_TX/ETH_MII_TXD1/ETH_RMII_TXD1) 135(PB5/TIM3_CH2/SPI1_MOSI/SPI3_MOSI/CAN2_RX/I2C1_SMBA/OTG_HS_ULPI_D7/ETH_PPS_OUT/DCMI_D10/I2S3_SD) 139(PB8/TIM4_CH3/TIM10_CH1/CAN1_RX/SDIO_D4/ETH_MII_TXD3/I2C1_SCL/DCMI_D6) 140(PB9/TIM4_CH4/TIM11_CH1/CAN1_TX/SDIO_D5/SPI2_NSS/I2C1_SDA/DCMI_D7/I2S2_WS); U13 9(CTS) 10(DSR) 11(RI) 12(DCD) 15(R232); U15 5(Vref); USB 1(VDD) 4(NC); USB2 4(NC)

## Notes on the sheet
- 电源部分
- MCU
- MCU_OSC
- R3可不焊接
- 夜视灯电路
- IR_CUT
- 4G图片传输原理图
- Labels drawn without touching a wire or pin: STM32_PC2_CTRL_485, STM32_PC13_UART5_TXD, STM32_PD2_UART5_RXD
- (in symbol 100UF/16V) +
- (in symbol PCAP) +

## Library data of the parts
BOOT0 = 创思水墨屏拨码开关
C1 C3 C5 C9 C12-C22 C36 C37 C40-C42 C45 C47-C52 C54 C55 C61 C120 = CAP: Capacitor
C2 = PCAP: Capacitor
C4 = 100UF/16V: Capacitor
C10 C11 C43 C44 C77 = Cap: Capacitor; Published: 8-Jun-2000; LatestRevisionDate: 17-Jul-2002; LatestRevisionNote: Re-released for DXP Platform.; Publisher: Altium Limited
  C43 C44: PackageReference: RAD-0.3
C23-C35 = 贴片电容
C56 C57 C59 C60 = CAP: Capcitor
D1 = TVS
D3 = DIDOE
D4 TVS1-TVS3 = Diode: Default Diode; Published: 8-Jun-2000; LatestRevisionDate: 17-Jul-2002; LatestRevisionNote: Re-released for DXP Platform.; PackageVersion: Sep-1996; PackageReference: SMC; Publisher: Altium Limited; Code_JEDEC: DO-214-AB
DHT11 = DHT11: 数字温湿度传感器
FUSE R11-R17 R19-R21 R23-R28 R30 R32 R33 R35-R46 R56-R59 R62-R69 R73 R75-R83 = RES2
JP1 JP2 LED = Header 2: Header, 2-Pin; LatestRevisionDate: 17-Jul-2002; LatestRevisionNote: Re-released for DXP Platform.; Publisher: Altium Limited
JTAG = CON10*2: Connector
L1 = INDUCTOR1
LED1-LED4 = 发光二极管
NET POW = LED
OV2640 = Header 9X2: Header, 9-Pin, Dual row; LatestRevisionDate: 17-Jul-2002; LatestRevisionNote: Re-released for DXP Platform.; Publisher: Altium Limited
Q2 = NPN: NPN Transistor
Q3 = J3Y_8050
Q4 = 8550
Q6 = MOSFET N
Q7 = AO3401
R1-R10 R18 R22 R31 R34 R74 = Res2: Resistor
  R1-R10 R18 R22 R31 R74: Published: *; LatestRevisionDate: *; LatestRevisionNote: *; PackageReference: *; Publisher: *; PackageDescription: *; Value: *
R47 R50-R55 R60 = Res2: Resistor; Value: 01C; Published: 8-Jun-2000; LatestRevisionDate: 17-Jul-2002; LatestRevisionNote: Re-released for DXP Platform.; PackageReference: AXIAL-0.4; Publisher: Altium Limited; PackageDescription: Axial Device, Thru-Hole; 2 Leads; 0.4 in Pin Spacing
R70 = Res2: Resistor; Value: 1K; Published: 8-Jun-2000; LatestRevisionDate: 17-Jul-2002; LatestRevisionNote: Re-released for DXP Platform.; PackageReference: AXIAL-0.4; Publisher: Altium Limited; PackageDescription: Axial Device, Thru-Hole; 2 Leads; 0.4 in Pin Spacing
R71 R72 = Res2: Resistor; Value: 10K; Published: 8-Jun-2000; LatestRevisionDate: 17-Jul-2002; LatestRevisionNote: Re-released for DXP Platform.; PackageReference: AXIAL-0.4; Publisher: Altium Limited; PackageDescription: Axial Device, Thru-Hole; 2 Leads; 0.4 in Pin Spacing
U1 = LM2567
U5 = EC20&7600CE_MINI_PCI
U7 = TXS0104
U9 = W25X16: W25X16;SST25VF016;MX25L1605
U11 = MAX3485
U12 = RT9193-33
U15 = SN65HVD230D
Y2 = CRYTAL
Y3 = 晶振